# Altium project FunctionGen.PrjPcb
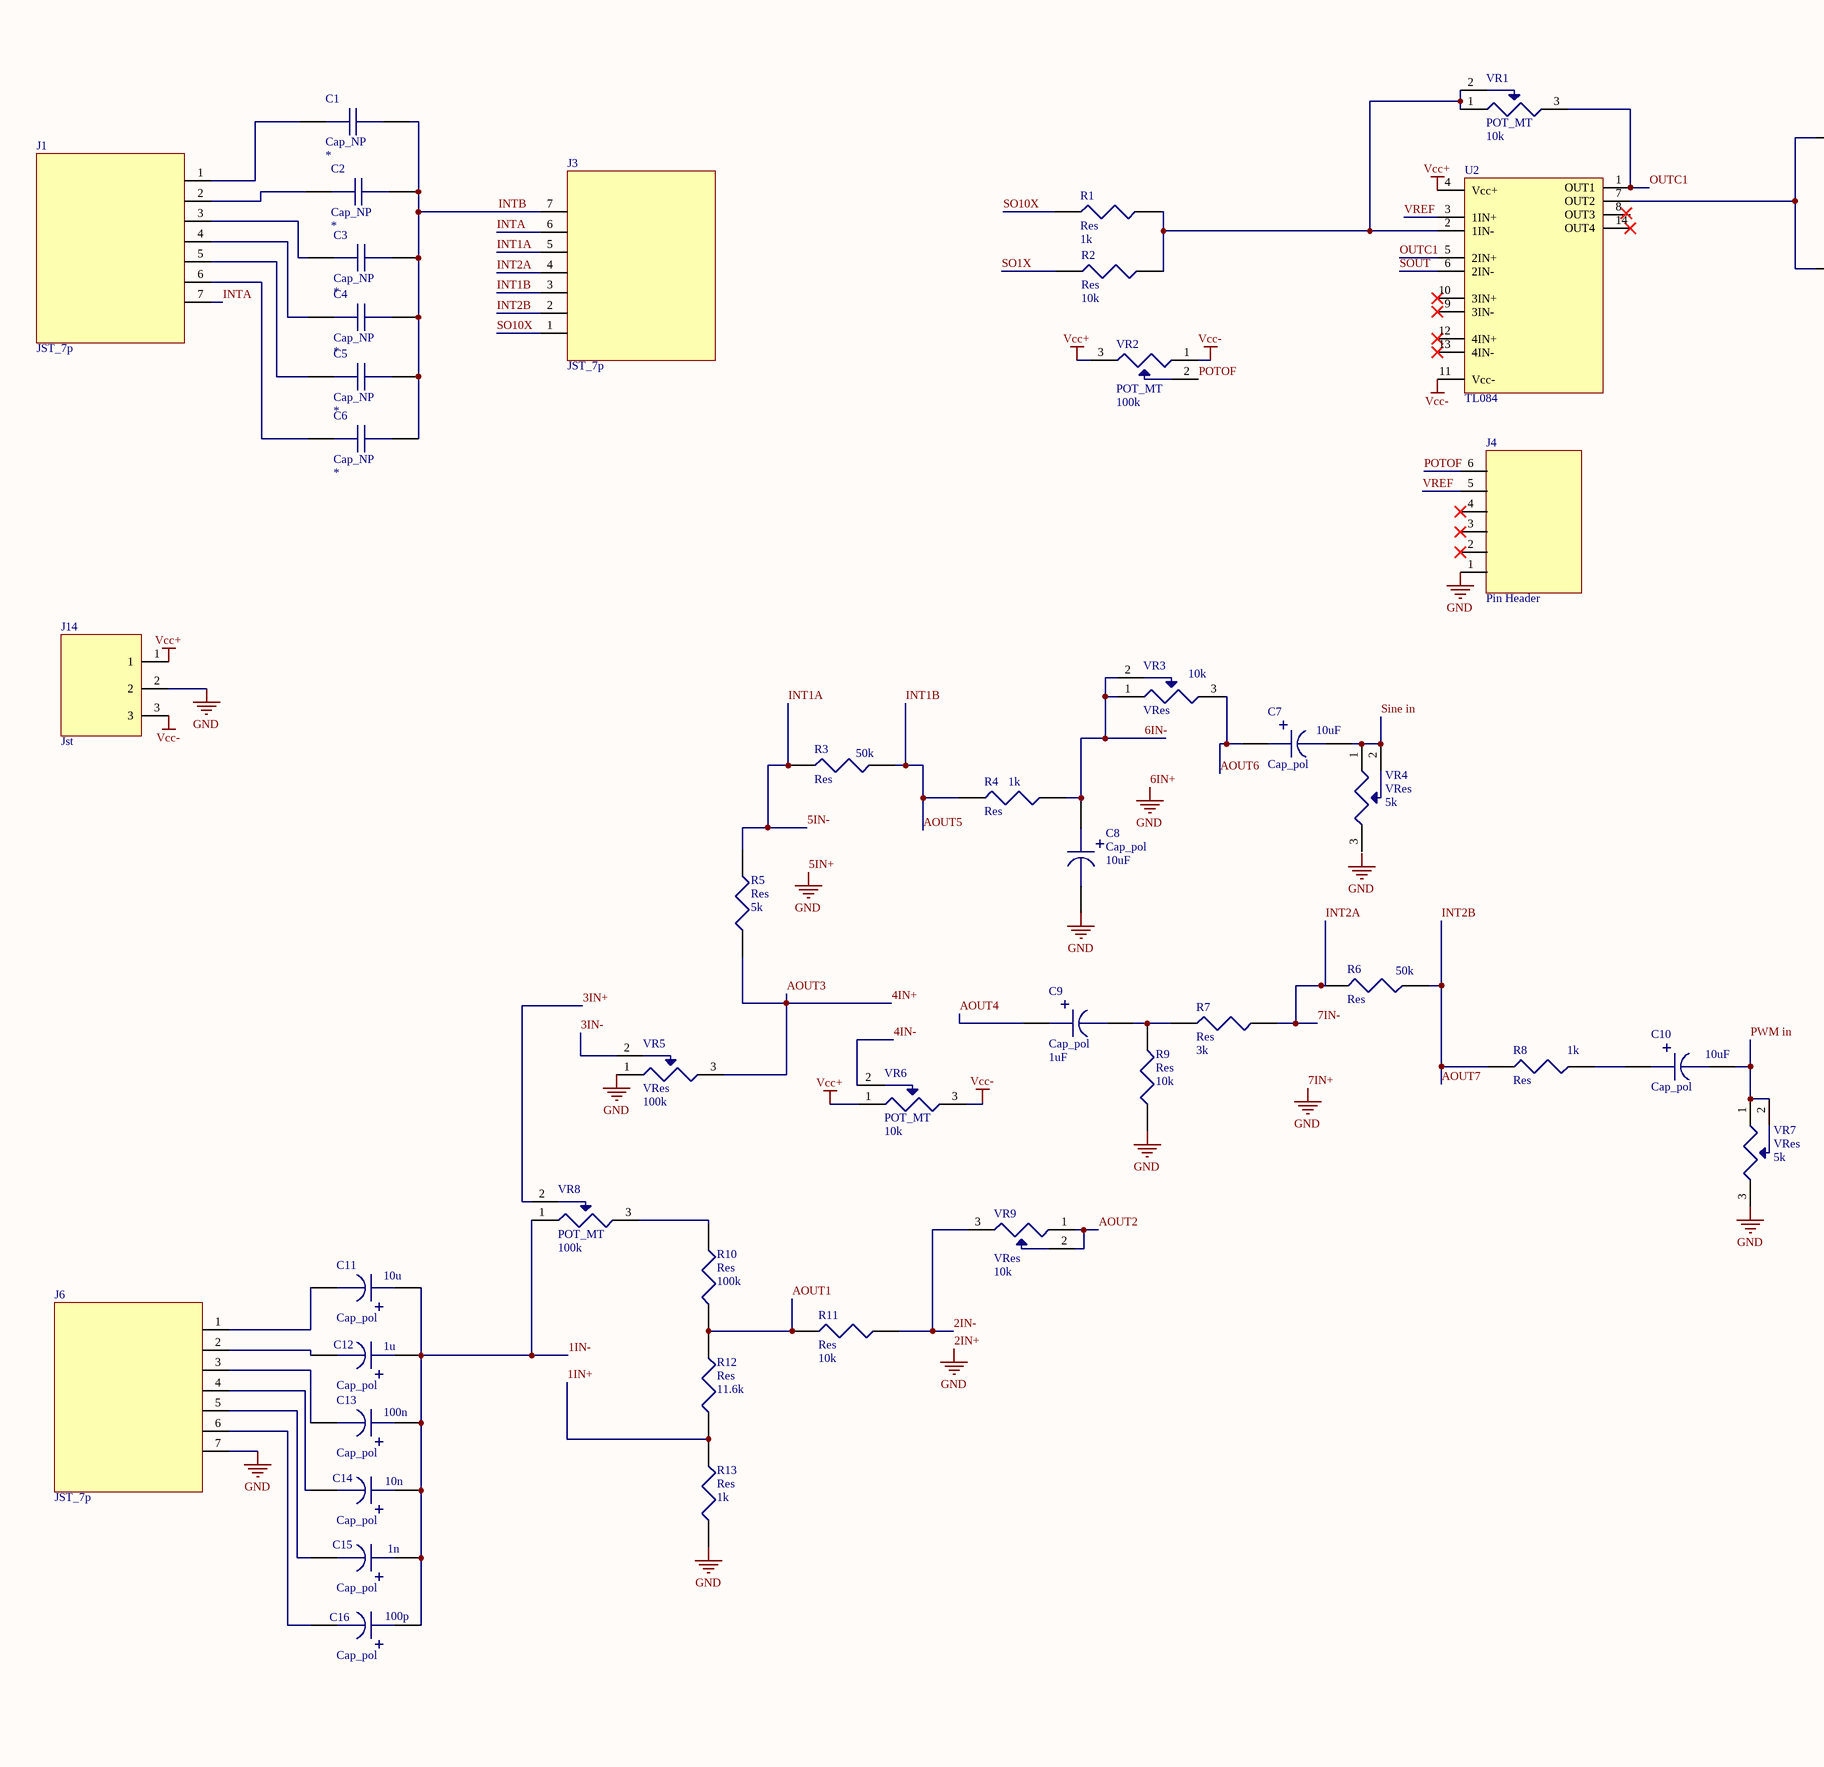
[diagram p0: funcgen.SchDoc, left]
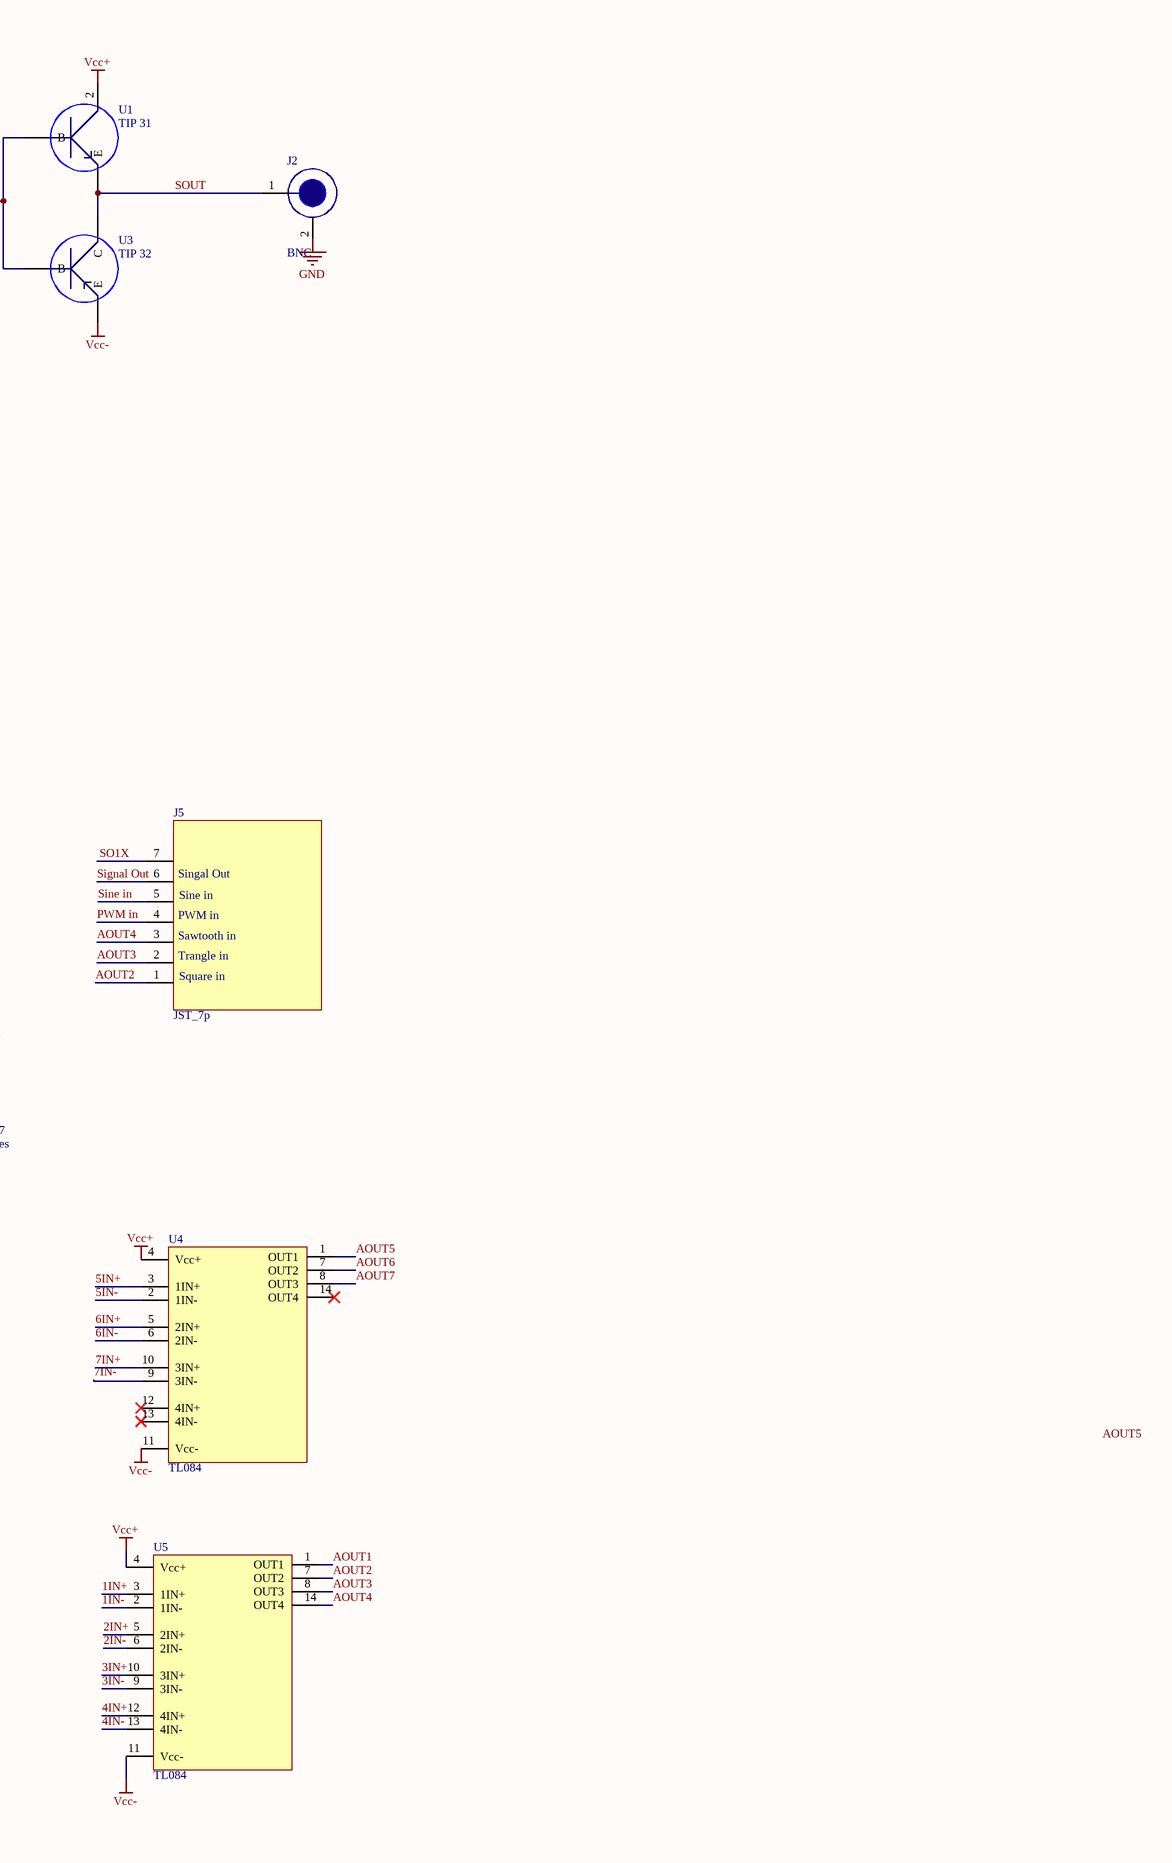
[diagram p1: funcgen.SchDoc, right]
3 sheets, 80 parts. Net scope: global (net labels, ports and power ports of the same name join across sheets).
Board files: funcgen.PcbDoc, button pad.PcbDoc, PwrSup.PcbDoc
Sheets:
  funcgen.SchDoc
  buttonpad.SchDoc
  PwrSup.SchDoc

## Sheet funcgen.SchDoc
size A2

### Parts
C1  Cap_NP  [Cap NP]
C2  Cap_NP  [Cap NP]
C3  Cap_NP  [Cap NP]
C4  Cap_NP  [Cap NP]
C5  Cap_NP  [Cap NP]
C6  Cap_NP  [Cap NP]
C7  Cap_pol  value 10uF  [Cap pol]
C8  Cap_pol  value 10uF  [Cap pol]
C9  Cap_pol  value 1uF  [Cap pol]
C10  Cap_pol  value 10uF  [Cap pol]
C11  Cap_pol  value 10u  [Cap pol]
C12  Cap_pol  value 1u  [Cap pol]
C13  Cap_pol  value 100n  [Cap pol]
C14  Cap_pol  value 10n  [Cap pol]
C15  Cap_pol  value 1n  [Cap pol]
C16  Cap_pol  value 100p  [Cap pol]
J1  JST_7p  [JST_7p]
J2  BNC  [BNC]
J3  JST_7p  [JST_7p]
J4  Pin Header  [JST_6p]
J5  JST_7p  [JST_7p]
J6  JST_7p  [JST_7p]
J14  Jst  [Jst_3p]
R1  Res  value 1k  [Res]
R2  Res  value 10k  [Res]
R3  Res  value 50k  [Res]
R4  Res  value 1k  [Res]
R5  Res  value 5k  [Res]
R6  Res  value 50k  [Res]
R7  Res  value 3k  [Res]
R8  Res  value 1k  [Res]
R9  Res  value 10k  [Res]
R10  Res  value 100k  [Res]
R11  Res  value 10k  [Res]
R12  Res  value 11.6k  [Res]
R13  Res  value 1k  [Res]
U1  TIP 31  [TIP 31]
U2  TL084  [TL084]
U3  TIP 32  [TIP 31]
U4  TL084  [TL084]
U5  TL084  [TL084]
VR1  POT_MT  value 10k  [POT MT]
VR2  POT_MT  value 100k  [POT MT]
VR3  VRes  value 10k  [VerRes]
VR4  VRes  value 5k  [VerRes]
VR5  VRes  value 100k  [VerRes]
VR6  POT_MT  value 10k  [POT MT]
VR7  VRes  value 5k  [VerRes]
VR8  POT_MT  value 100k  [POT MT]
VR9  VRes  value 10k  [VerRes]

### Nets
2IN+: C8.2 J4.1 J6.7 J14.2 R9.1 R13.1 U4.3(1IN+) U4.5(2IN+) U4.10(3IN+) U5.5(2IN+) VR5.1 VR7.3  [also labelled 5IN+, 6IN+, 7IN+, GND]
Vcc+: J14.1 U1.2 U2.4(Vcc+) U4.4(Vcc+) U5.4(Vcc+) VR2.3 VR6.1
Vcc-: J14.3 U2.11(Vcc-) U3.3(E) U4.11(Vcc-) U5.11(Vcc-) VR2.1 VR6.3
1IN+: R12.1 R13.2 U5.3(1IN+)
1IN-: C11.1 C12.1 C13.1 C14.1 C15.1 C16.1 U5.2(1IN-) VR8.1
2IN-: R11.2 U5.6(2IN-) VR9.3
3IN+: U5.10(3IN+) VR8.2
3IN-: U5.9(3IN-) VR5.2
4IN+: J5.2 R5.1 U5.8(OUT3) U5.12(4IN+) VR5.3  [also labelled AOUT3]
4IN-: U5.13(4IN-) VR6.2
5IN-: J3.5 R3.1 R5.2 U4.2(1IN-)  [also labelled INT1A]
6IN-: C8.1 R4.2 U4.6(2IN-) VR3.1 VR3.2
7IN-: J3.4 R6.2 R7.1 U4.9(3IN-)  [also labelled INT2A]
AOUT1: R10.2 R11.1 R12.2 U5.1(OUT1)
AOUT2: J5.1 U5.7(OUT2) VR9.1 VR9.2
AOUT4: C9.1 J5.3 U5.14(OUT4)
AOUT5: J3.3 R3.2 R4.1 U4.1(OUT1)  [also labelled INT1B]
AOUT6: C7.1 U4.7(OUT2) VR3.3
AOUT7: J3.2 R6.1 R8.1 U4.8(OUT3)  [also labelled INT2B]
INTA: J1.7 J3.6
INTB: C1.2 C2.2 C3.2 C4.2 C5.2 C6.2 J3.7
OUTC1: U2.1(OUT1) U2.5(2IN+) VR1.3
POTOF: J4.6 VR2.2
PWM in: C10.2 J5.4 VR7.1 VR7.2
Signal Out: J5.6
Sine in: C7.2 J5.5 VR4.1 VR4.2
SO1X: J5.7 R2.1
SO10X: J3.1 R1.1
SOUT: J2.1 U1.3(E) U2.6(2IN-) U3.2(C)
VREF: J4.5 U2.3(1IN+)
NetC1_1: C1.1 J1.1
NetC2_1: C2.1 J1.2
NetC3_1: C3.1 J1.3
NetC4_1: C4.1 J1.4
NetC5_1: C5.1 J1.5
NetC6_1: C6.1 J1.6
NetC9_2: C9.2 R7.2 R9.2
NetC10_1: C10.1 R8.2
NetC11_2: C11.2 J6.1
NetC12_2: C12.2 J6.2
NetC13_2: C13.2 J6.3
NetC14_2: C14.2 J6.4
NetC15_2: C15.2 J6.5
NetC16_2: C16.2 J6.6
NetR1_2: R1.2 R2.2 U2.2(1IN-) VR1.1 VR1.2
NetR10_1: R10.1 VR8.3
NetU1_1: U1.1(B) U2.7(OUT2) U3.1(B)

Not connected (* = marked no-connect by the designer): J2 2; J4 2* 3* 4*; U2 8(OUT3) 9(3IN-)* 10(3IN+)* 12(4IN+)* 13(4IN-)* 14(OUT4)*; U4 12(4IN+)* 13(4IN-)* 14(OUT4)*; VR4 3

### Notes on the sheet
- (near J5) PWM in
- (near J5) Singal Out
- (near J5) Sine in
- (near J5) Trangle in
- (near J5) Sawtooth in
- (near J5) Square in
- Labels drawn without touching a wire or pin: AOUT5, GND

### Library data of the parts
J4 = JST_6p
J14 = Jst_3p
C1-C6 = Cap_NP: Value: *

## Sheet buttonpad.SchDoc
size A3
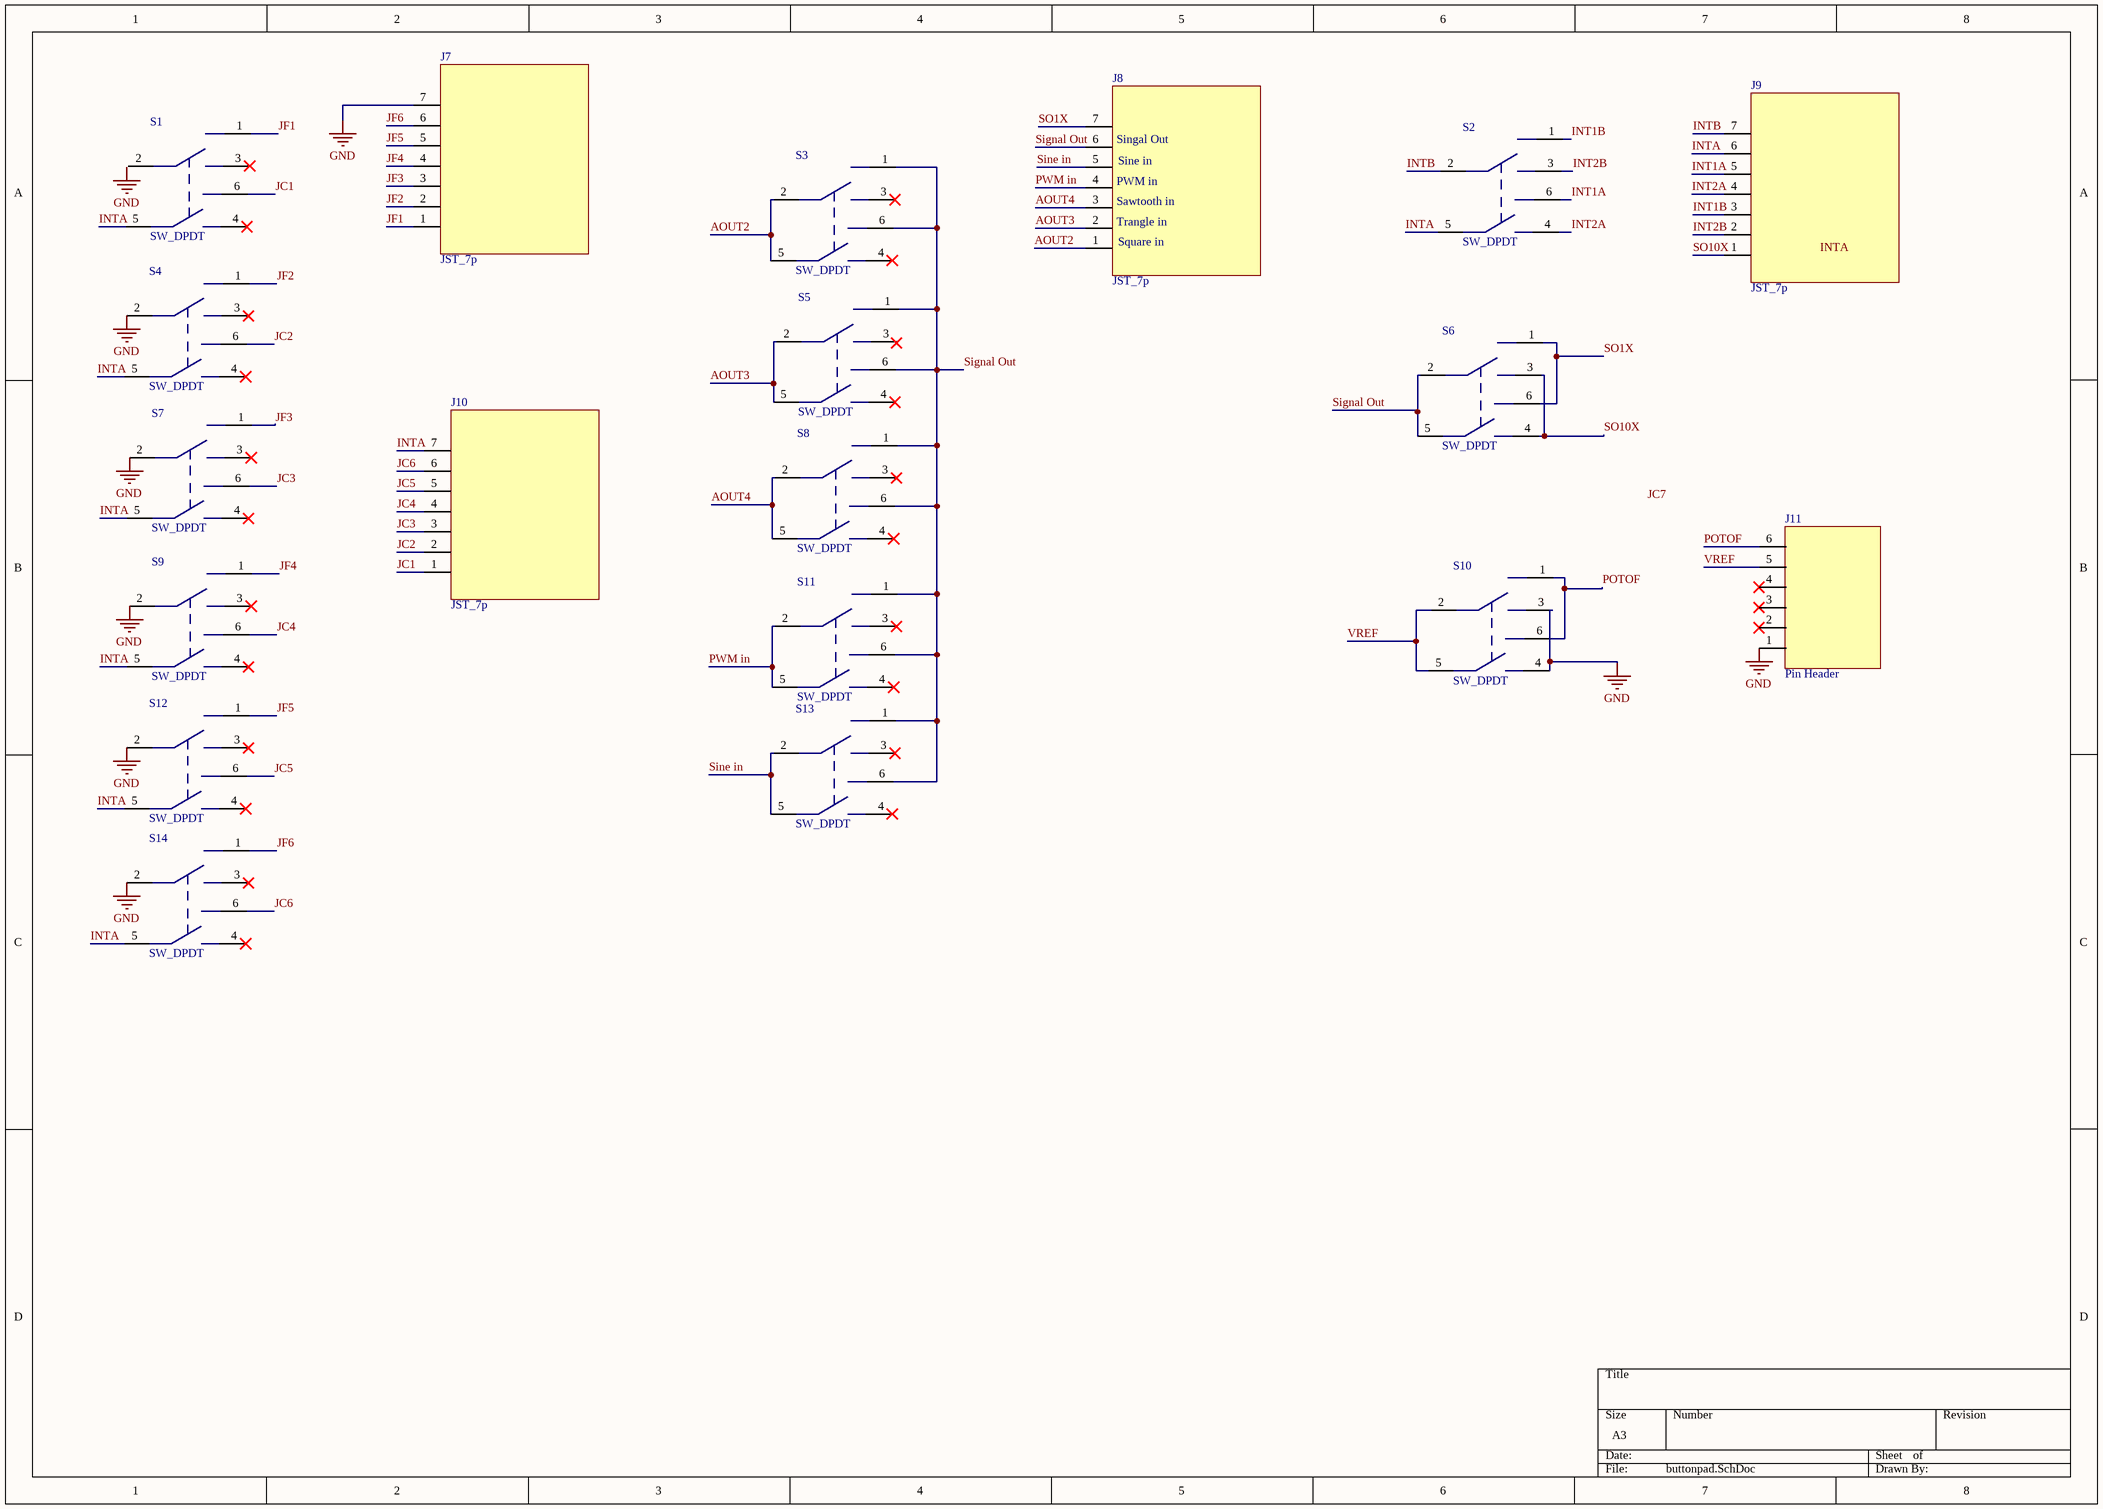
[diagram p2: buttonpad.SchDoc]

### Parts
J7  JST_7p  [JST_7p]
J8  JST_7p  [JST_7p]
J9  JST_7p  [JST_7p]
J10  JST_7p  [JST_7p]
J11  Pin Header  [JST_6p]
S1  SW_DPDT  [SW DPDT]
S2  SW_DPDT  [SW DPDT]
S3  SW_DPDT  [SW DPDT]
S4  SW_DPDT  [SW DPDT]
S5  SW_DPDT  [SW DPDT]
S6  SW_DPDT  [SW DPDT]
S7  SW_DPDT  [SW DPDT]
S8  SW_DPDT  [SW DPDT]
S9  SW_DPDT  [SW DPDT]
S10  SW_DPDT  [SW DPDT]
S11  SW_DPDT  [SW DPDT]
S12  SW_DPDT  [SW DPDT]
S13  SW_DPDT  [SW DPDT]
S14  SW_DPDT  [SW DPDT]

### Nets
GND: J7.7 J11.1 S4.2 S7.2 S9.2 S10.3 S10.4 S12.2 S14.2  [project net 2IN+]
AOUT2: J8.1 S3.2 S3.5
AOUT3: J8.2 S5.2 S5.5  [project net 4IN+]
AOUT4: J8.3 S8.2 S8.5
INT1A: J9.5 S2.6  [project net 5IN-]
INT1B: J9.3 S2.1  [project net AOUT5]
INT2A: J9.4 S2.4  [project net 7IN-]
INT2B: J9.2 S2.3  [project net AOUT7]
INTA: J9.6 J10.7 S1.5 S2.5 S4.5 S7.5 S9.5 S12.5 S14.5
INTB: J9.7 S2.2
JC1: J10.1 S1.6
JC2: J10.2 S4.6
JC3: J10.3 S7.6
JC4: J10.4 S9.6
JC5: J10.5 S12.6
JC6: J10.6 S14.6
JF1: J7.1 S1.1
JF2: J7.2 S4.1
JF3: J7.3 S7.1
JF4: J7.4 S9.1
JF5: J7.5 S12.1
JF6: J7.6 S14.1
POTOF: J11.6 S10.1 S10.6
PWM in: J8.4 S11.2 S11.5
Signal Out: J8.6 S3.1 S3.6 S5.1 S5.6 S6.2 S6.5 S8.1 S8.6 S11.1 S11.6 S13.1 S13.6
Sine in: J8.5 S13.2 S13.5
SO1X: J8.7 S6.1 S6.6
SO10X: J9.1 S6.3 S6.4
VREF: J11.5 S10.2 S10.5

Not connected (* = marked no-connect by the designer): J11 2* 3* 4*; S1 2 3* 4*; S3 3* 4*; S4 3* 4*; S5 3 4*; S7 3* 4*; S8 3* 4*; S9 3* 4*; S11 3* 4*; S12 3* 4*; S13 3* 4*; S14 3* 4*

### Notes on the sheet
- (near J8) Singal Out
- (near J8) Sine in
- (near J8) Trangle in
- (near J8) Sawtooth in
- (near J8) PWM in
- (near J8) Square in
- Labels drawn without touching a wire or pin: GND, INTA, JC7

### Library data of the parts
J11 = JST_6p

## Sheet PwrSup.SchDoc
size A
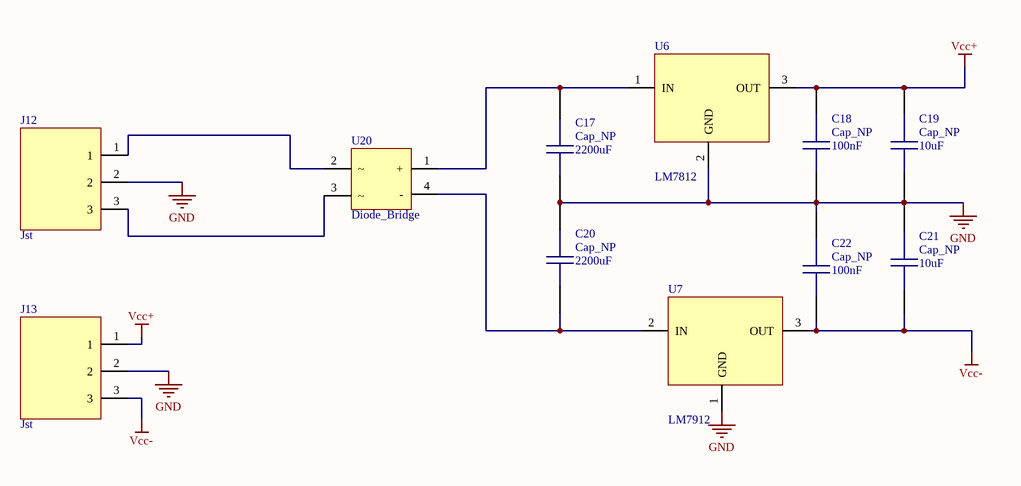
[diagram p3: PwrSup.SchDoc]

### Parts
C17  Cap_NP  value 2200uF  [Cap NP]
C18  Cap_NP  value 100nF  [Cap NP]
C19  Cap_NP  value 10uF  [Cap NP]
C20  Cap_NP  value 2200uF  [Cap NP]
C21  Cap_NP  value 10uF  [Cap NP]
C22  Cap_NP  value 100nF  [Cap NP]
J12  Jst  [Jst_3p]
J13  Jst  [Jst_3p]
U6  LM7812  [TIP 31]
U7  LM7912  [TIP 31]
U20  Diode_Bridge  [Diode Bridge 2]

### Nets
GND: C17.1 C18.1 C19.1 C20.2 C21.2 C22.2 J12.2 J13.2 U6.2(GND) U7.1(GND)  [project net 2IN+]
Vcc+: C18.2 C19.2 J13.1 U6.3(OUT)
Vcc-: C21.1 C22.1 J13.3 U7.3(OUT)
NetC17_2: C17.2 U6.1(IN) U20.1(+)
NetC20_1: C20.1 U7.2(IN) U20.4(-)
NetJ12_1: J12.1 U20.2
NetJ12_3: J12.3 U20.3

### Library data of the parts
J12 J13 = Jst_3p

## Nets that join several sheets
2IN+: funcgen (12 pins), buttonpad (9 pins), PwrSup (10 pins)
Vcc+: funcgen (7 pins), PwrSup (C18.2 C19.2 J13.1 U6.3)
Vcc-: funcgen (7 pins), PwrSup (C21.1 C22.1 J13.3 U7.3)
4IN+: funcgen (5 pins), buttonpad (J8.2 S5.2 S5.5)
5IN-: funcgen (J3.5 R3.1 R5.2 U4.2), buttonpad (J9.5 S2.6)
7IN-: funcgen (J3.4 R6.2 R7.1 U4.9), buttonpad (J9.4 S2.4)
AOUT2: funcgen (J5.1 U5.7 VR9.1 VR9.2), buttonpad (J8.1 S3.2 S3.5)
AOUT4: funcgen (C9.1 J5.3 U5.14), buttonpad (J8.3 S8.2 S8.5)
AOUT5: funcgen (J3.3 R3.2 R4.1 U4.1), buttonpad (J9.3 S2.1)
AOUT7: funcgen (J3.2 R6.1 R8.1 U4.8), buttonpad (J9.2 S2.3)
INTA: funcgen (J1.7 J3.6), buttonpad (9 pins)
INTB: funcgen (7 pins), buttonpad (J9.7 S2.2)
POTOF: funcgen (J4.6 VR2.2), buttonpad (J11.6 S10.1 S10.6)
PWM in: funcgen (C10.2 J5.4 VR7.1 VR7.2), buttonpad (J8.4 S11.2 S11.5)
Signal Out: funcgen (J5.6), buttonpad (13 pins)
Sine in: funcgen (C7.2 J5.5 VR4.1 VR4.2), buttonpad (J8.5 S13.2 S13.5)
SO1X: funcgen (J5.7 R2.1), buttonpad (J8.7 S6.1 S6.6)
SO10X: funcgen (J3.1 R1.1), buttonpad (J9.1 S6.3 S6.4)
VREF: funcgen (J4.5 U2.3), buttonpad (J11.5 S10.2 S10.5)

## Assembly variants
Not fit MT VR: not fitted VR1 VR2 VR6 VR8